# Altium schematic sheet PP8_MMC.SchDoc
size A
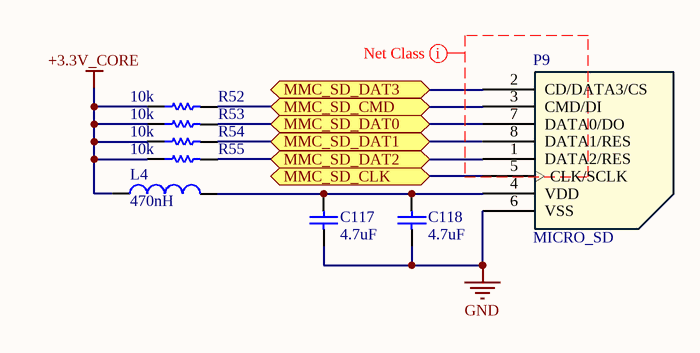
[diagram p0: PP8_MMC.SchDoc]

## Parts
C117  value 4.7uF  [CAPC1608X08]  (hidden comment: Cap 4.7uF)
C118  value 4.7uF  [CAPC1608X08]  (hidden comment: Cap 4.7uF)
L4  value 470nH  [INDM1608X08N]  (hidden comment: Inductor High Frequency)
P9  MICRO_SD  [WURTH ELEKTRONIK_693072010801]
R52  value 10k  [RESC1608X05]  (hidden comment: Res 10k)
R53  value 10k  [RESC1608X05]  (hidden comment: Res 10k)
R54  value 10k  [RESC1608X05]  (hidden comment: Res 10k)
R55  value 10k  [RESC1608X05]  (hidden comment: Res 10k)

## Ports
MMC_SD_CLK, MMC_SD_CMD, MMC_SD_DAT0, MMC_SD_DAT1, MMC_SD_DAT2, MMC_SD_DAT3

## Nets
+3.3V_CORE: L4.1 R52.1 R53.1 R54.1 R55.1
GND: C117.1 C118.2 P9.6(VSS)
MMC_SD_CLK: P9.5(CLK/SCLK) ; port MMC_SD_CLK
MMC_SD_CMD: P9.3(CMD/DI) R52.2 ; port MMC_SD_CMD
MMC_SD_DAT0: P9.7(DATA0/DO) R53.2 ; port MMC_SD_DAT0
MMC_SD_DAT1: P9.8(DATA1/RES) R54.2 ; port MMC_SD_DAT1
MMC_SD_DAT2: P9.1(DATA2/RES) R55.2 ; port MMC_SD_DAT2
MMC_SD_DAT3: P9.2(CD/DATA3/CS) ; port MMC_SD_DAT3
NetC117_2: C117.2 C118.1 L4.2 P9.4(VDD)

## Layout directives
net class MMC: (no net found under the mark)

## Library data of the parts
C117 C118 = Cap: Capacitor; Fabricant: MURATA; Fournisseur: Farnell; RefFabricant: GRT188R61E475KE13D; RefFournisseur: 2672159; DataSheet: http://www.farnell.com/datasheets/2165958.pdf; Case: 0603 [1608 Metric]
L4 = Inductor: Fabricant: WURTH ELEKTRONIK; Fournisseur: Farnell; RefFournisseur: 2424740; RefFabricant: 744786247A; DataSheet: http://www.farnell.com/datasheets/1818786.pdf; Case: 0603 [1608 Metric]
P9 = MicroSD: Embase mémoire; Fournisseur: Farnell; Fabricant: WURTH ELEKTRONIK; RefFabricant: 693072010801; RefFournisseur: 2081364; DataSheet: http://www.farnell.com/datasheets/1912449.pdf
R52-R55 = Res1: Resistor; Fabricant: TE CONNECTIVITY; Fournisseur: Farnell; RefFabricant: CRGH0603J10K; RefFournisseur: 2331740; Case: 0603 [1608 Metric]; DataSheet: CRGH0603J10K